# Altium schematic sheet 10 SENSORS,CAN,485.SchDoc
size 513 x 386 mm
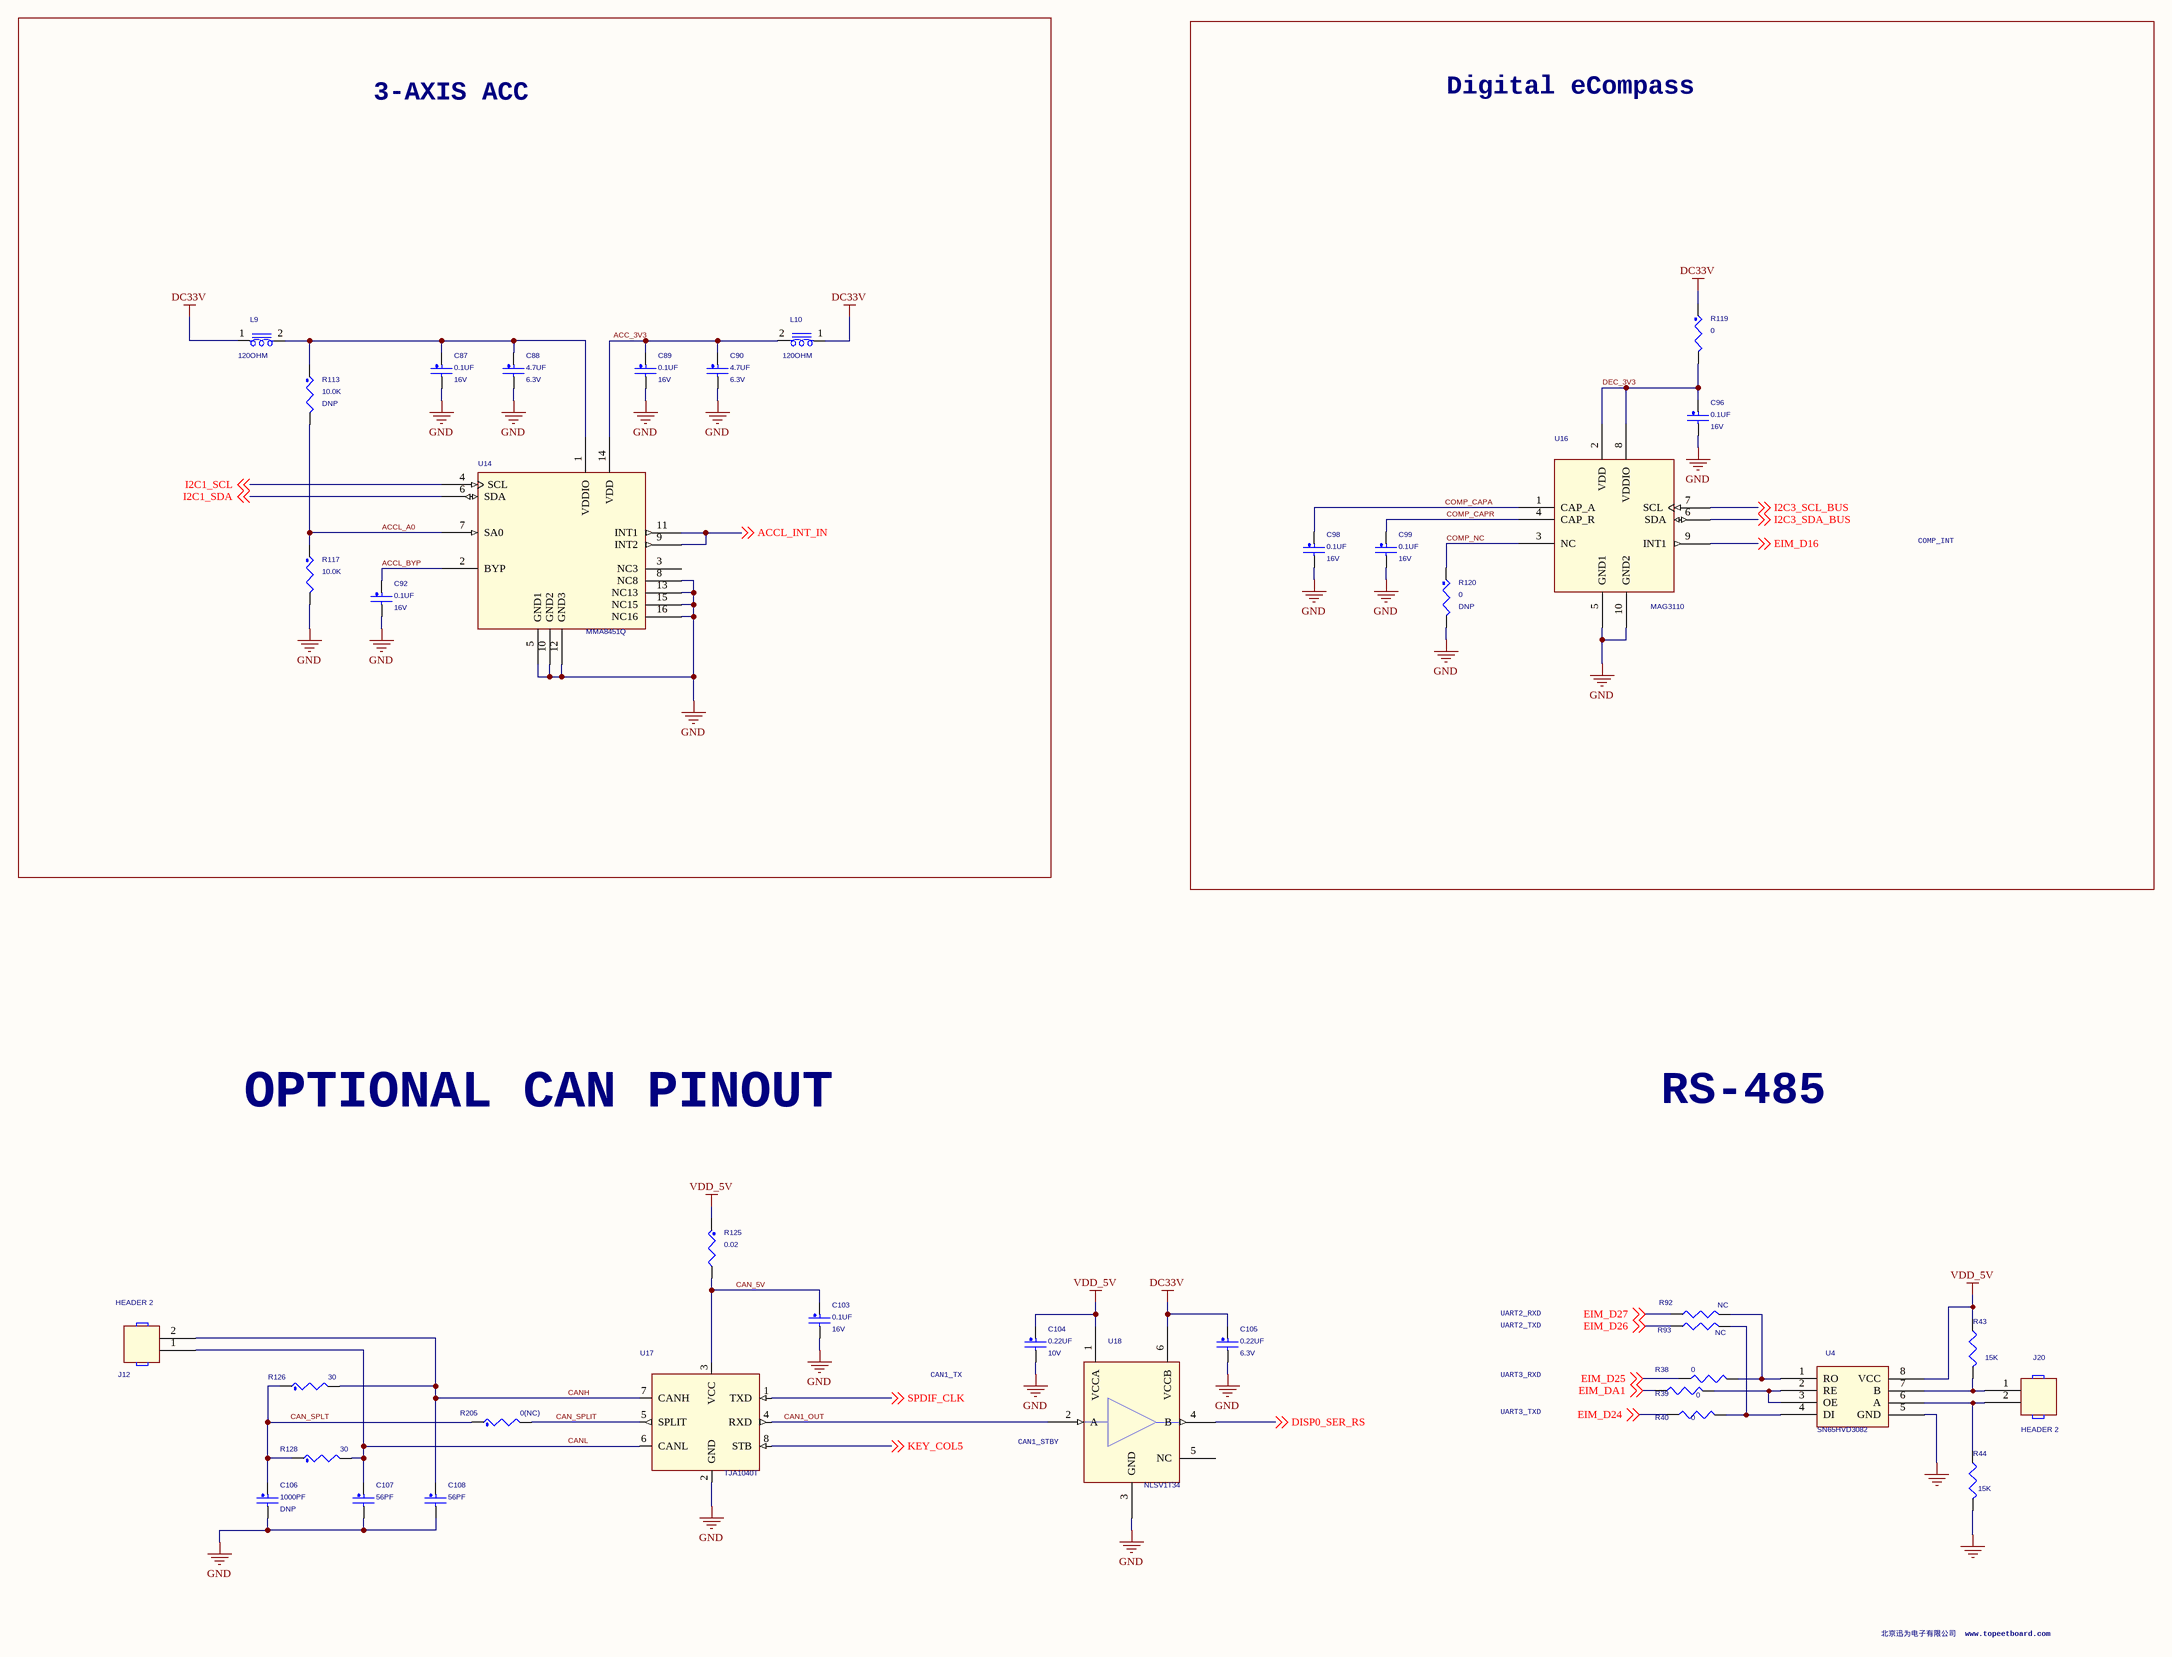
[diagram p0: 10 SENSORS,CAN,485.SchDoc]

## Parts
C87  0.1UF  WVDC: 16V  [C0402]
C88  4.7UF  WVDC: 6.3V  [C0603]
C89  0.1UF  WVDC: 16V  [C0402]
C90  4.7UF  WVDC: 6.3V  [C0603]
C92  0.1UF  WVDC: 16V  [C0402]
C96  0.1UF  WVDC: 16V  [C0402]
C98  0.1UF  WVDC: 16V  [C0402]
C99  0.1UF  WVDC: 16V  [C0402]
C103  0.1UF  WVDC: 16V  [C0402]
C104  0.22UF  WVDC: 10V  [C0402]
C105  0.22UF  WVDC: 6.3V  [C0402]
C106  1000PF  ASSY_OPT: DNP  [C0402]
C107  56PF  [C0402]
C108  56PF  [C0402]
J12  HEADER 2  [header2-3_8]
J20  HEADER 2  [header2-3_8]
L9  120OHM  [R0805]
L10  120OHM  [R0805]
R38  0  [R1005]
R39  0  [R1005]
R40  0  [R1005]
R43  15K  [R1005]
R44  15K  [R1005]
R92  NC  [R1005]
R93  NC  [R1005]
R113  10.0K  ASSY_OPT: DNP  [R0402]
R117  10.0K  [R0402]
R119  0  [R0402]
R120  0  ASSY_OPT: DNP  [R0402]
R125  0.02  [R0402]
R126  30  [R0402]
R128  30  [R0402]
R205  0(NC)  [R0402]
U4  SN65HVD3082  [SOIC8]
U14  MMA8451Q  [qfn5x3_0p5_3x3]
U16  MAG3110  [DFN_10_0P4_2X2]
U17  TJA1040T  [SO8_1P27_4X5]
U18  NLSV1T34  [ullga6_1p45x1_0p5mm]

## Blocks framed on the sheet
3-AXIS ACC: C87-C90 C92 L9 L10 R113 R117 U14
Digital eCompass: C96 C98 C99 R119 R120 U16

## Nets
DC33V: C105.1 L9.1 L10.1 R119.1 U18.6(VCCB)
GND: C87.2 C88.2 C89.2 C90.2 C92.2 C96.2 C98.2 C99.2 C103.2 C104.2 C105.2 C106.2 C107.2 C108.2 R44.1 R117.2 R120.2 U4.5(GND) U14.5(GND1) U14.8(NC8) U14.10(GND2) U14.12(GND3) U14.13(NC13) U14.15(NC15) U14.16(NC16) U16.5(GND1) U16.10(GND2) U17.2(GND) U18.3(GND)
VDD_5V: C104.1 R43.2 R125.1 U4.8(VCC) U18.1(VCCA)
ACC_3V3: C89.1 C90.1 L10.2 U14.14(VDD)
ACCL_A0: R113.2 R117.1 U14.7(SA0)
ACCL_BYP: C92.1 U14.2(BYP)
ACCL_INT_IN: U14.9(INT2) U14.11(INT1) ; off-sheet ACCL_INT_IN
CAN1_OUT: U17.4(RXD) U18.2(A)
CAN_5V: C103.1 R125.2 U17.3(VCC)
CAN_SPLIT: R205.2 U17.5(SPLIT)
CAN_SPLT: C106.1 R126.1 R128.1 R205.1
CANH: C108.1 J12.2 R126.2 U17.7(CANH)
CANL: C107.1 J12.1 R128.2 U17.6(CANL)
COMP_CAPA: C98.1 U16.1(CAP_A)
COMP_CAPR: C99.1 U16.4(CAP_R)
COMP_NC: R120.1 U16.3(NC)
DEC_3V3: C96.1 R119.2 U16.2(VDD) U16.8(VDDIO)
DISP0_SER_RS: U18.4(B) ; off-sheet DISP0_SER_RS
EIM_D16: U16.9(INT1) ; off-sheet EIM_D16
EIM_D24: R40.2 ; off-sheet EIM_D24
EIM_D25: R38.2 ; off-sheet EIM_D25
EIM_D26: R93.1 ; off-sheet EIM_D26
EIM_D27: R92.1 ; off-sheet EIM_D27
EIM_DA1: R39.2 ; off-sheet EIM_DA1
I2C1_SCL: U14.4(SCL) ; off-sheet I2C1_SCL
I2C1_SDA: U14.6(SDA) ; off-sheet I2C1_SDA
I2C3_SCL_BUS: U16.7(SCL) ; off-sheet I2C3_SCL_BUS
I2C3_SDA_BUS: U16.6(SDA) ; off-sheet I2C3_SDA_BUS
KEY_COL5: U17.8(STB) ; off-sheet KEY_COL5
SPDIF_CLK: U17.1(TXD) ; off-sheet SPDIF_CLK
NetC87_1: C87.1 C88.1 L9.2 R113.1 U14.1(VDDIO)
NetJ20_1: J20.1 R43.1 U4.7(B)
NetJ20_2: J20.2 R44.2 U4.6(A)
NetR38_1: R38.1 R92.2 U4.1(RO)
NetR39_1: R39.1 U4.2(RE) U4.3(OE)
NetR40_1: R40.1 R93.2 U4.4(DI)

Not connected (* = marked no-connect by the designer): U14 3(NC3); U18 5(NC)

## Notes on the sheet
- COMP_INT
- RS-485
- OPTIONAL CAN PINOUT
- UART2_RXD
- UART2_TXD
- CAN1_TX
- UART3_TXD
- UART3_RXD
- (near U18) CAN1_STBY
- 北京迅为电子有限公司  www.topeetboard.com

## Library data of the parts
C87 C89 C96 C98 C99 C103 = CAP_NP: CAP CER 0.1UF 16V 10% X7R 0402; AGILE_PN: 150-75182; MFG_NAME01: KEMET; MFG_PN01: C0402C104K4RAC; CAD_APPROVED: Yes; FPLIST: CC0402_25,CC0402_HD,0402_CC; SIGNAL_MODEL: DEFAULT_CAPACITOR_100000pF_2_1; Tolerance: 10%; ROHS: Yes; HEIGHT: 0.635MM; VOLTAGE: 16V
C88 = CAP_NP: CAP CER 4.7UF 6.3V 10% X5R 0603; AGILE_PN: 150-75487; MFG_NAME01: VENKEL COMPANY; MFG_PN01: C0603X5R6R3-475KNP; CAD_APPROVED: Yes; FPLIST: CC0603_OV,CC0603,0603_CC; SIGNAL_MODEL: DEFAULT_CAPACITOR_4.7e+06pF_2_1; Tolerance: 10%; ROHS: Yes; HEIGHT: 1.016MM; VOLTAGE: 6.3V
C90 = CAP_NP: CAP CER 4.7UF 6.3V 10% X5R 0603; SIGNAL_MODEL: DEFAULT_CAPACITOR_4.7e+06pF_2_1; FPLIST: CC0603_OV,CC0603,0603_CC; CAD_APPROVED: Yes; MFG_PN01: C0603X5R6R3-475KNP; MFG_NAME01: VENKEL COMPANY; AGILE_PN: 150-75487; VOLTAGE: 6.3V; HEIGHT: 1.016MM; ROHS: Yes; Tolerance: 10%
C92 = CAP_NP: CAP CER 0.1UF 16V 10% X7R 0402; SIGNAL_MODEL: DEFAULT_CAPACITOR_100000pF_2_1; AGILE_PN: 150-75182; MFG_NAME01: KEMET; MFG_PN01: C0402C104K4RAC; CAD_APPROVED: Yes; FPLIST: CC0402_25,CC0402_HD,0402_CC; VOLTAGE: 16V; Tolerance: 10%; ROHS: Yes; HEIGHT: 0.635MM
C104 = CAP_NP: CAP CER 0.22UF 10V 20% X5R 0201; ROOM: CPU; AGILE_PN: 150-78815; MFG_NAME01: Taiyo Yuden; MFG_PN01: LMK063BJ224MP-F; CAD_APPROVED: Yes; FPLIST: CC0201,CC0201_HD,0201_CC,CC_0201_CIR,0201_CC_012SM; PRIORITY_PN: 021-00278; SIGNAL_MODEL: DEFAULT_CAPACITOR_220000pF_2_1; VOLTAGE: 10V; Tolerance: 20%; ROHS: Yes; HEIGHT: 0.33MM
C105 = CAP_NP: CAP CER 0.22UF 6.3V 20% X5R 0201; PRIORITY_PN: 021-00278; FPLIST: CC0201,CC0201_HD,0201_CC,cc_0201_cir; CAD_APPROVED: Yes; MFG_PN01: JMK063BJ224MP-F; MFG_NAME01: TAIYO YUDEN; AGILE_PN: 150-77852; ROOM: CPU; SIGNAL_MODEL: DEFAULT_CAPACITOR_220000pF_2_1; VOLTAGE: 6.3V; HEIGHT: 0.33 MM; ROHS: Yes; Tolerance: 20%
C106 = CAP_NP: CAP CER 1000PF 50V 5% C0G 0402; FPLIST: CC0402_25,CC0402_HD,0402_CC; CAD_APPROVED: Yes; MFG_PN01: C0402C0G500-102JNP; MFG_NAME01: VENKEL COMPANY; AGILE_PN: 150-75591; SIGNAL_MODEL: DEFAULT_CAPACITOR_1000pF_2_1; HEIGHT: 0.635MM; ROHS: Yes
C107 C108 = CAP_NP: CAP CER 56PF 25V 5% C0G CC0201; FPLIST: CC0201,CC0201_HD,0201_CC; CAD_APPROVED: Yes; MFG_PN01: GRM0335C1E560JD01D; MFG_NAME01: MURATA; AGILE_PN: 150-76810; SIGNAL_MODEL: DEFAULT_CAPACITOR_56pF_2_1; VOLTAGE: 25V; HEIGHT: 0.33MM; ROHS: Yes; Tolerance: 5%
L9 = BEAD_0: IND FER BEAD 120OHM@100MHZ 2A 25% 0603; PART_TYPE: FERRITE; ROOM: RGMII_PHY; MFG_PN01: BLM18PG121SH1; AGILE_PN: 180-30008; FPLIST: IND_0603,0603_CC; CAD_APPROVED: Yes; MFG_NAME01: MURATA; PRIORITY_PN: 024-00067; ROHS: Yes; HEIGHT: 0.95MM; Tolerance: 25%
L10 = BEAD_0: IND FER BEAD 120OHM@100MHZ 2A 25% 0603; PART_TYPE: FERRITE; PRIORITY_PN: 024-00067; MFG_NAME01: MURATA; CAD_APPROVED: Yes; FPLIST: IND_0603,0603_CC; AGILE_PN: 180-30008; MFG_PN01: BLM18PG121SH1; ROOM: RGMII_PHY; Tolerance: 25%; HEIGHT: 0.95MM; ROHS: Yes
R38-R40 R43 R44 R92 R93 = R1005_0_Dup1
R113 R117 = RES_Dup1: RES MF 10.0K 1/16W 1% AEC-Q200 0402; FPLIST: RC0402_25,RC0402_HD,0402_CC; CAD_APPROVED: Yes; MFG_PN01: RK73H1ETTP1002F; MFG_NAME01: KOA SPEER; AGILE_PN: 470-75416; SIGNAL_MODEL: DEFAULT_RESISTOR_10000OHM_2_1; ROHS: Yes; Tolerance: 1%
R119 R120 = RES_Dup1: RES MF ZERO OHM 1/10W -- 0402; AGILE_PN: 470-79965; MFG_NAME01: Panasonic; MFG_PN01: ERJ-2GE0R00X; CAD_APPROVED: Yes; FPLIST: RC0402_25,RC0402_HD,RC0402_X2,0402_CC; SIGNAL_MODEL: DEFAULT_RESISTOR_0.001OHM_2_1; ROHS: Yes
R125 = RES_Dup1: RES MF 0.02 OHM 1/8W 1% 0805; AGILE_PN: 470-76820; MFG_NAME01: VISHAY INTERTECHNOLOGY; MFG_PN01: WSL0805R0200FEA; CAD_APPROVED: Yes; FPLIST: RC0805_OV,RC0805,0805_CC; SIGNAL_MODEL: DEFAULT_RESISTOR_0.02OHM_2_1; ROHS: Yes
R126 = RES_Dup1: RES MF 30 OHM 1/16W 1% 0402; AGILE_PN: 470-30688; MFG_NAME01: KOA SPEER; MFG_PN01: RK73H1ETTP30R0F; CAD_APPROVED: Yes; FPLIST: RC0402_25,RC0402_HD,0402_CC; SIGNAL_MODEL: DEFAULT_RESISTOR_30OHM_2_1; Tolerance: 1%; ROHS: Yes
R128 R205 = RES_Dup1: RES MF 30 OHM 1/16W 1% 0402; FPLIST: RC0402_25,RC0402_HD,0402_CC; CAD_APPROVED: Yes; MFG_PN01: RK73H1ETTP30R0F; MFG_NAME01: KOA SPEER; AGILE_PN: 470-30688; SIGNAL_MODEL: DEFAULT_RESISTOR_30OHM_2_1; ROHS: Yes; Tolerance: 1%
U14 = MMA8451Q_16P_A: IC 3-AXIS DIG ACCELEROMETER 14/8BIT 1.95-3.6V QFN16; AGILE_PN: 315-79075; MFG_NAME01: FREESCALE SEMICONDUCTOR; MFG_PN01: MMA8451QT; CAD_APPROVED: Yes; FPLIST: qfn5x3_0p5_3x3,qfn16_0p5_3p03x3p03; ROHS: Yes; HEIGHT: 1MM
U16 = MAG3112_DFN_10P: IC 3-AXIS DIGITAL MAGNETOMETER 1.95-3.6V DFN10; CAD_APPROVED: Yes; MFG_PN01: MAG3110FC; MFG_NAME01: FREESCALE SEMICONDUCTOR; AGILE_PN: 312-79970; HEIGHT: 0.9MM; ROHS: Yes
U17 = TJA1040T_SO_8P: IC XCVR CAN HS 5V SO8; AGILE_PN: 312-79676; MFG_NAME01: NXP SEMICONDUCTORS; CAD_APPROVED: Yes; MFG_PN01: TJA1040T; ROHS: Yes; HEIGHT: 1.75 MM
U18 = NLSV1T34: IC VXLTR 1 BIT DUAL-SUPPLY 0.9-4.5V 613AF; CAD_APPROVED: Yes; MFG_PN01: NLSV1T34AMX1TCG; MFG_NAME01: On Semiconductor; AGILE_PN: 312-79552; HEIGHT: 0.4MM; ROHS: Yes